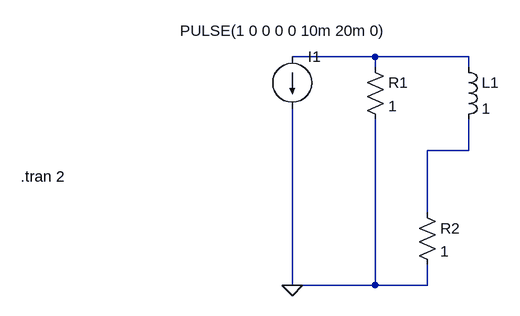
[diagram p0: schematic inductor_bad_current_lpf.asc]
inductor_bad_current_lpf.asc, the LTspice schematic file:
Version 4
SHEET 1 880 680
WIRE 336 160 208 160
WIRE 480 160 336 160
WIRE 336 176 336 160
WIRE 480 176 480 160
WIRE 480 304 480 256
WIRE 480 304 416 304
WIRE 416 400 416 304
WIRE 208 512 208 240
WIRE 336 512 336 256
WIRE 336 512 208 512
WIRE 416 512 416 480
WIRE 416 512 336 512
FLAG 208 512 0
SYMBOL current 208 160 R0
WINDOW 3 -173 -40 Left 2
WINDOW 123 0 0 Left 0
WINDOW 39 0 0 Left 0
SYMATTR InstName I1
SYMATTR Value PULSE(1 0 0 0 0 10m 20m 0)
SYMBOL res 320 160 R0
SYMATTR InstName R1
SYMATTR Value 1
SYMBOL res 400 384 R0
SYMATTR InstName R2
SYMATTR Value 1
SYMBOL ind 464 160 R0
SYMATTR InstName L1
SYMATTR Value 1
TEXT -210 344 Left 2 !.tran 2

The netlist it stands for:
* inductor_bad_current_lpf.asc
I1 N001 0 PULSE(1 0 0 0 0 10m 20m 0)
R1 N001 0 1
R2 N002 0 1
L1 N001 N002 1
.tran 2
.backanno
.end